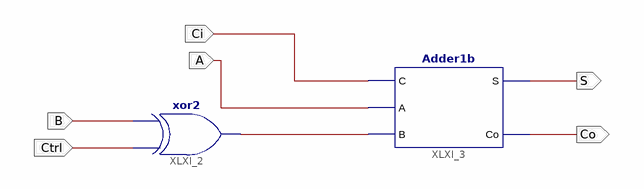
[diagram p0: schematic sheet 1]
// Xilinx ISE schematic AddSub1b.sch (kintex7) as structural Verilog: 2 symbols, 6 ports
module AddSub1b (
  input  Ci,
  input  A,
  input  B,
  input  Ctrl,
  output S,
  output Co
);

  wire XLXN_3;

  xor XLXI_2 (XLXN_3, Ctrl, B);
  Adder1b XLXI_3 (.C(Ci), .A(A), .B(XLXN_3), .S(S), .Co(Co));
endmodule
